# Altium schematic sheet SHT1x.SchDoc
size A
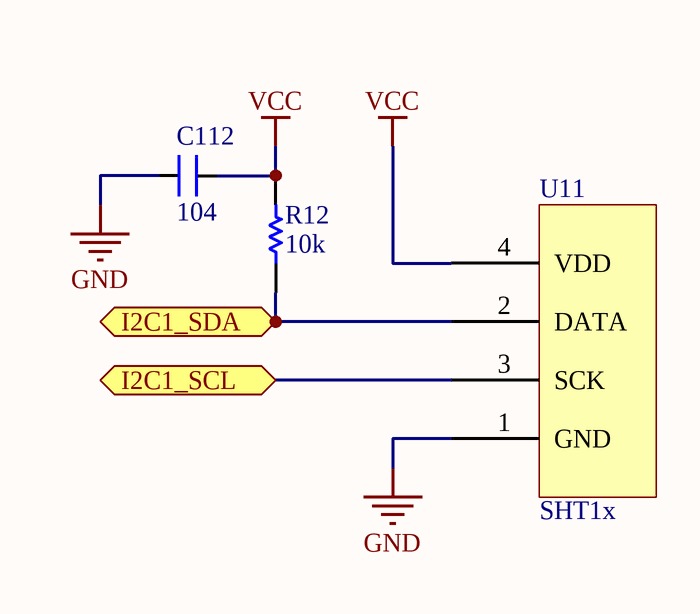
[diagram p0: SHT1x.SchDoc]

## Parts
C112  value 104  [CAPC1608N]  (hidden comment: CAP NP)
R12  value 10k  [RESC2012N_F]  (hidden comment: Res)
U11  SHT1x  [SHT1x]

## Ports
I2C1_SCL, I2C1_SDA

## Nets
GND: C112.2 U11.1(GND)
VCC: C112.1 R12.2 U11.4(VDD)
I2C1_SCL: U11.3(SCK) ; port I2C1_SCL
I2C1_SDA: R12.1 U11.2(DATA) ; port I2C1_SDA